# EAGLE design lab6 (EAGLE 7.2.0)
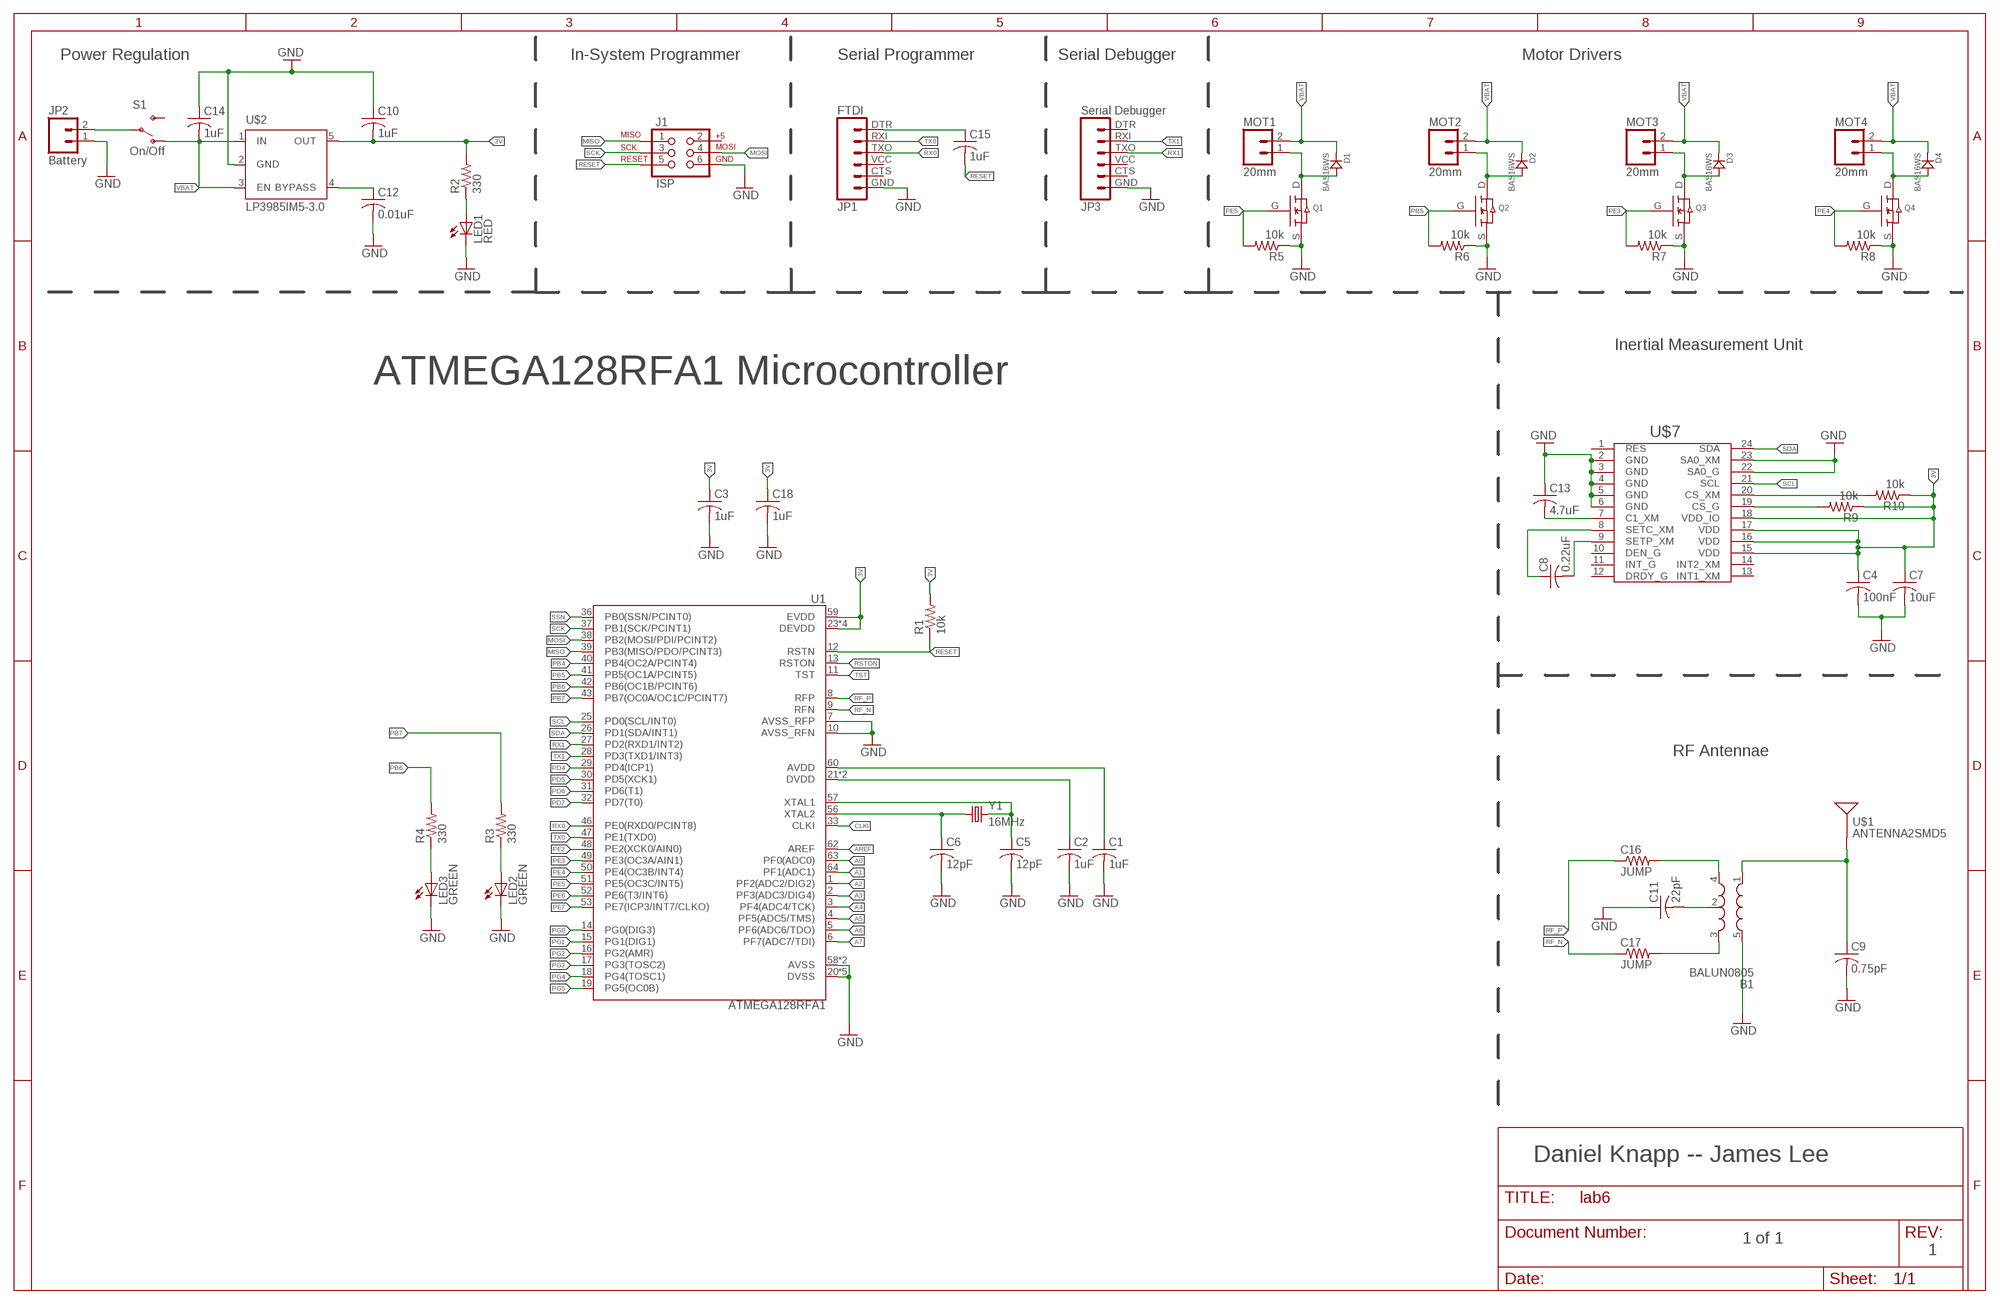
[diagram p0: schematic, sheet 1]

## Parts
B1  BALUN0805  [BALUN]
C1  1uF  C-USC0805  [C0805]
C2  1uF  C-USC0805  [C0805]
C3  1uF  C-USC0805  [C0805]
C4  100nF  C-USC0805  [C0805]
C5  12pF  C-USC0805  [C0805]
C6  12pF  C-USC0805  [C0805]
C7  10uF  C-USC0805  [C0805]
C8  0.22uF  C-USC0805  [C0805]
C9  0.75pF  C-USC0805  [C0805]
C10  1uF  C-USC0805  [C0805]
C11  22pF  C-USC0805  [C0805]
C12  0.01uF  C-USC0805  [C0805]
C13  4.7uF  C-USC0805  [C0805]
C14  1uF  C-USC0805  [C0805]
C15  1uF  C-USC0805  [C0805]
C16  JUMP  R-US_R0805  [R0805]
C17  JUMP  R-US_R0805  [R0805]
C18  1uF  C-USC0805  [C0805]
D1  BAS16WS  [BAS16WS]
D2  BAS16WS  [BAS16WS]
D3  BAS16WS  [BAS16WS]
D4  BAS16WS  [BAS16WS]
J1  ISP  AVR_SPI_PRG_6NS  [2X3-NS]
JP1  FTDI  FTDI_BASICPTH  [FTDI_BASIC]
JP2  Battery  M02PTH  [1X02]
JP3  Serial Debugger  FTDI_BASICPTH  [FTDI_BASIC]
LED1  RED  LEDCHIP-LED0805  [CHIP-LED0805]
LED2  GREEN  LEDCHIP-LED0805  [CHIP-LED0805]
LED3  GREEN  LEDCHIP-LED0805  [CHIP-LED0805]
MOT1  20mm  M02PTH  [1X02]
MOT2  20mm  M02PTH  [1X02]
MOT3  20mm  M02PTH  [1X02]
MOT4  20mm  M02PTH  [1X02]
Q1  SI2302CDS  [SI2302CDS]
Q2  SI2302CDS  [SI2302CDS]
Q3  SI2302CDS  [SI2302CDS]
Q4  SI2302CDS  [SI2302CDS]
R1  10k  R-US_R0805  [R0805]
R2  330  R-US_R0805  [R0805]
R3  330  R-US_R0805  [R0805]
R4  330  R-US_R0805  [R0805]
R5  10k  R-US_R0805  [R0805]
R6  10k  R-US_R0805  [R0805]
R7  10k  R-US_R0805  [R0805]
R8  10k  R-US_R0805  [R0805]
R9  10k  R-US_R0805  [R0805]
R10  10k  R-US_R0805  [R0805]
S1  On/Off  SWITCH-SPDTPTH  [SWITCH-SPDT]
U1  ATMEGA128RFA1  [QFN-64]
U$1  ANTENNA2SMD5  [ANTENNA-CHIP5]
U$2  LP3985IM5-3.0  [SOT23-DBV]
U$7  LSM9DS0  [LSM9DS0]
Y1  16MHz  CRYSTAL5X3  [CRYSTAL-SMD-5X3]

## Nets
3V: C3.1 C4.1 C7.1 C10.2 C18.1 R1.2 R2.2 R9.1 R10.1 U1.23(DEVDD) U1.34(DEVDD) U1.44(DEVDD) U1.54(DEVDD) U1.59(EVDD) U$2.5(OUT) U$7.15(VDD) U$7.16(VDD) U$7.17(VDD) U$7.18(VDD_IO)
A0: U1.63(PF0(ADC0))
A1: U1.64(PF1(ADC1))
A2: U1.1(PF2(ADC2/DIG2))
A3: U1.2(PF3(ADC3/DIG4))
A4: U1.3(PF4(ADC4/TCK))
A5: U1.4(PF5(ADC5/TMS))
A6: U1.5(PF6(ADC6/TDO))
A7: U1.6(PF7(ADC7/TDI))
AREF: U1.62(AREF)
CLKI: U1.33(CLKI)
GND: B1.5(GND) C1.2 C2.2 C3.2 C4.2 C5.2 C6.2 C7.2 C9.2 C10.1 C11.1 C12.2 C13.1 C14.1 C18.2 J1.6 JP1.GND JP2.1 JP3.GND LED1.C LED2.C LED3.C Q1.S Q2.S Q3.S Q4.S R5.1 R6.1 R7.1 R8.1 U1.7(AVSS_RFP) U1.10(AVSS_RFN) U1.20(DVSS) U1.24(DVSS) U1.35(DVSS) U1.45(DVSS) U1.55(DVSS) U1.58(AVSS) U1.61(AVSS) U$2.2(GND) U$7.2(GND) U$7.3(GND) U$7.4(GND) U$7.5(GND) U$7.6(GND) U$7.22(SA0_G) U$7.23(SA0_XM)
MISO: J1.1 U1.39(PB3(MISO/PDO/PCINT3))
MOSI: J1.4 U1.38(PB2(MOSI/PDI/PCINT2))
N$2: C12.1 U$2.4(BYPASS)
N$3: C15.1 JP1.DTR
N$4: LED1.A R2.1
N$5: C5.1 U1.57(XTAL1) Y1.3
N$6: JP2.2 S1.2(P)
N$7: C6.1 U1.56(XTAL2) Y1.1
N$8: C2.1 U1.21(DVDD) U1.22(DVDD)
N$9: C1.1 U1.60(AVDD)
N$10: B1.3(OUT2) C17.2
N$11: B1.2(GND) C11.2
N$12: B1.4(OUT1) C16.2
N$15: B1.1(IN) C9.1 U$1.FEED(SIGNAL)
N$16: LED3.A R4.1
N$17: LED2.A R3.1
N$18: D1.P$2 MOT1.1 Q1.D
N$20: D2.P$2 MOT2.1 Q2.D
N$22: D3.P$2 MOT3.1 Q3.D
N$24: D4.P$2 MOT4.1 Q4.D
N$25: C8.1 U$7.8(SETC_XM)
N$26: C8.2 U$7.9(SETP_XM)
N$27: C13.2 U$7.7(C1_XM)
N$29: R9.2 U$7.19(CS_G)
N$30: R10.2 U$7.20(CS_XM)
PB4: U1.40(PB4(OC2A/PCINT4))
PB5: Q2.G R6.2 U1.41(PB5(OC1A/PCINT5))
PB6: R4.2 U1.42(PB6(OC1B/PCINT6))
PB7: R3.2 U1.43(PB7(OC0A/OC1C/PCINT7))
PD4: U1.29(PD4(ICP1))
PD5: U1.30(PD5(XCK1))
PD6: U1.31(PD6(T1))
PD7: U1.32(PD7(T0))
PE2: U1.48(PE2(XCK0/AIN0))
PE3: Q3.G R7.2 U1.49(PE3(OC3A/AIN1))
PE4: Q4.G R8.2 U1.50(PE4(OC3B/INT4))
PE5: Q1.G R5.2 U1.51(PE5(OC3C/INT5))
PE6: U1.52(PE6(T3/INT6))
PE7: U1.53(PE7(ICP3/INT7/CLKO))
PG0: U1.14(PG0(DIG3))
PG1: U1.15(PG1(DIG1))
PG2: U1.16(PG2(AMR))
PG3: U1.17(PG3(TOSC2))
PG4: U1.18(PG4(TOSC1))
PG5: U1.19(PG5(OC0B))
RESET: C15.2 J1.5 R1.1 U1.12(RSTN)
RF_N: C17.1 U1.9(RFN)
RF_P: C16.1 U1.8(RFP)
RSTON: U1.13(RSTON)
RX0: JP1.TXO U1.46(PE0(RXD0/PCINT8))
RX1: JP3.TXO U1.27(PD2(RXD1/INT2))
SCK: J1.3 U1.37(PB1(SCK/PCINT1))
SCL: U1.25(PD0(SCL/INT0)) U$7.21(SCL)
SDA: U1.26(PD1(SDA/INT1)) U$7.24(SDA)
SSN: U1.36(PB0(SSN/PCINT0))
TST: U1.11(TST)
TX0: JP1.RXI U1.47(PE1(TXD0))
TX1: JP3.RXI U1.28(PD3(TXD1/INT3))
VBAT: C14.2 D1.P$1 D2.P$1 D3.P$1 D4.P$1 MOT1.2 MOT2.2 MOT3.2 MOT4.2 S1.1(O) U$2.1(IN) U$2.3(EN)
Unconnected: J1.2 JP1.CTS JP1.VCC JP3.CTS JP3.DTR JP3.VCC S1.3(S) U$7.1(RES) U$7.10(DEN_G) U$7.11(INT_G) U$7.12(DRDY_G) U$7.13(INT1_XM) U$7.14(INT2_XM)

## Notes on the sheet
- Power Regulation | In-System Programmer | Serial Programmer | Serial Debugger | Motor Drivers
- Inertial Measurement Unit
- ATMEGA128RFA1 Microcontroller
- RF Antennae
- Daniel Knapp -- James Lee
- 1 of 1
- 1

## Library data of the parts
B1 = lab5_comps:BALUN: 0805 footprint balun- Ember 351/357
C1-C15 C18 = lab5_comps:C-US: CAPACITOR, American symbol
C16 C17 R1-R10 = lab5_comps:R-US_: RESISTOR, American symbol
D1-D4 = lab5_comps:BAS16WS; CREATOR: Daniel Knapp; DIST: Digikey
J1 = lab5_comps:AVR_SPI_PRG_6: AVR ISP 6 Pin This is the reduced ISP connector for AVR programming. Common on Arduino. This footprint will take up less PCB space and can be used with a 10-pin to 6-pin adapter such as SKU: BOB-08508
JP1 JP3 = lab5_comps:FTDI_BASIC: FTDI Basic header with labels
JP2 MOT1-MOT4 = lab5_comps:M02: Header 2 Standard 2-pin 0.1" header. Use with straight break away headers (SKU : PRT-00116), right angle break away headers (PRT-00553), swiss pins (PRT-00743), machine pins (PRT-00117), and female headers (PRT-00115). Molex polarized connector foot print use with SKU : PRT-08233 with associated crimp pins and housings.
LED1-LED3 = lab5_comps:LED: LED OSRAM: - CHIPLED LG R971, LG N971, LY N971, LG Q971, LY Q971, LO R971, LY R971 LH N974, LH R974 LS Q976, LO Q976, LY Q976 LO Q996 - Hyper CHIPLED LW Q18S LB Q993, LB Q99A, LB R99A - SideLED LS A670, LO A670, LY A670, LG A670, LP A670 LB A673, LV A673, LT A673, LW A673 LH A674 LY A675 LS A676, LA A676, LO A676, LY A676, LW A676 LS A679, LY A679, LG A679 - Hyper Micro SIDELED® LS Y876, LA Y876, LO Y876, LY Y876 LT Y87S - SmartLED LW L88C, LW L88S LB L89C, LB L89S, LG L890 LS L89K, LO L89K, LY L89K LS L896, LA L896, LO L896, LY L896 - TOPLED LS T670, LO T670, LY T670, LG T670, LP T670 LSG T670, LSP T670, LSY T670, LOP T670, LYG T670 LG T671, LOG T671, LSG T671 LB T673, LV T673, LT T673, LW T673 LH T674 LS T676, LA T676, LO T676, LY T676, LB T676, LH T676, LSB T676, LW T676 LB T67C, LV T67C, LT T67C, LS T67K, LO T67K, LY T67K, LW E67C LS E67B, LA E67B, LO E67B, LY E67B, LB E67C, LV E67C, LT E67C LW T67C LS T679, LY T679, LG T679 LS T770, LO T770, LY T770, LG T770, LP T770 LB T773, LV T773, LT T773, LW T773 LH T774 LS E675, LA E675, LY E675, LS T675 LS T776, LA T776, LO T776, LY T776, LB T776 LHGB T686 LT T68C, LB T68C - Hyper Mini TOPLED® LB M676 - Mini TOPLED Santana® LG M470 LS M47K, LO M47K, LY M47K Source: http://www.osram.convergy.de LUXEON: - LUMILED® LXK2-PW12-R00, LXK2-PW12-S00, LXK2-PW14-U00, LXK2-PW14-V00 LXK2-PM12-R00, LXK2-PM12-S00, LXK2-PM14-U00 LXK2-PE12-Q00, LXK2-PE12-R00, LXK2-PE12-S00, LXK2-PE14-T00, LXK2-PE14-U00 LXK2-PB12-K00, LXK2-PB12-L00, LXK2-PB12-M00, LXK2-PB14-N00, LXK2-PB14-P00, LXK2-PB14-Q00 LXK2-PR12-L00, LXK2-PR12-M00, LXK2-PR14-Q00, LXK2-PR14-R00 LXK2-PD12-Q00, LXK2-PD12-R00, LXK2-PD12-S00 LXK2-PH12-R00, LXK2-PH12-S00 LXK2-PL12-P00, LXK2-PL12-Q00, LXK2-PL12-R00 Source: www.luxeon.com KINGBRIGHT: KA-3528ASYC Source: www.kingbright.com
Q1-Q4 = lab5_comps:SI2302CDS; CREATOR: Daniel Knapp; DIST: Digikey
S1 = lab5_comps:SWITCH-SPDT: SPDT Switch Simple slide switch, Spark Fun Electronics SKU : COM-00102 DPDT SMT slide switch, AYZ0202, SWCH-08179; PROD_ID: SWCH-08261
U1 = lab5_comps:ATMEGA128RFA1: ATmega128RFA1 8-bit AVR Microcontroller with Low Power 2.4GHz Transceiver for ZigBee and IEEE 802.15.4
U$1 = lab5_comps:ANTENNA2: Chip antenna Single endded antenna. Common with smaller chip antennas. CHIP4 package is the GPS Chip Antenna SKU: GPS-08418. CHIP5 package is 2.4GHz chip antenna SKU: WRL-00144.
U$2 = lab5_comps:LP3985IM5-3.0
U$7 = lab5_comps:LSM9DS0; CREATOR: Daniel Knapp; DIST: Digikey
Y1 = lab5_comps:CRYSTAL: Various standard crystals. Proven footprints. Spark Fun Electronics SKU : COM-00534

## Board
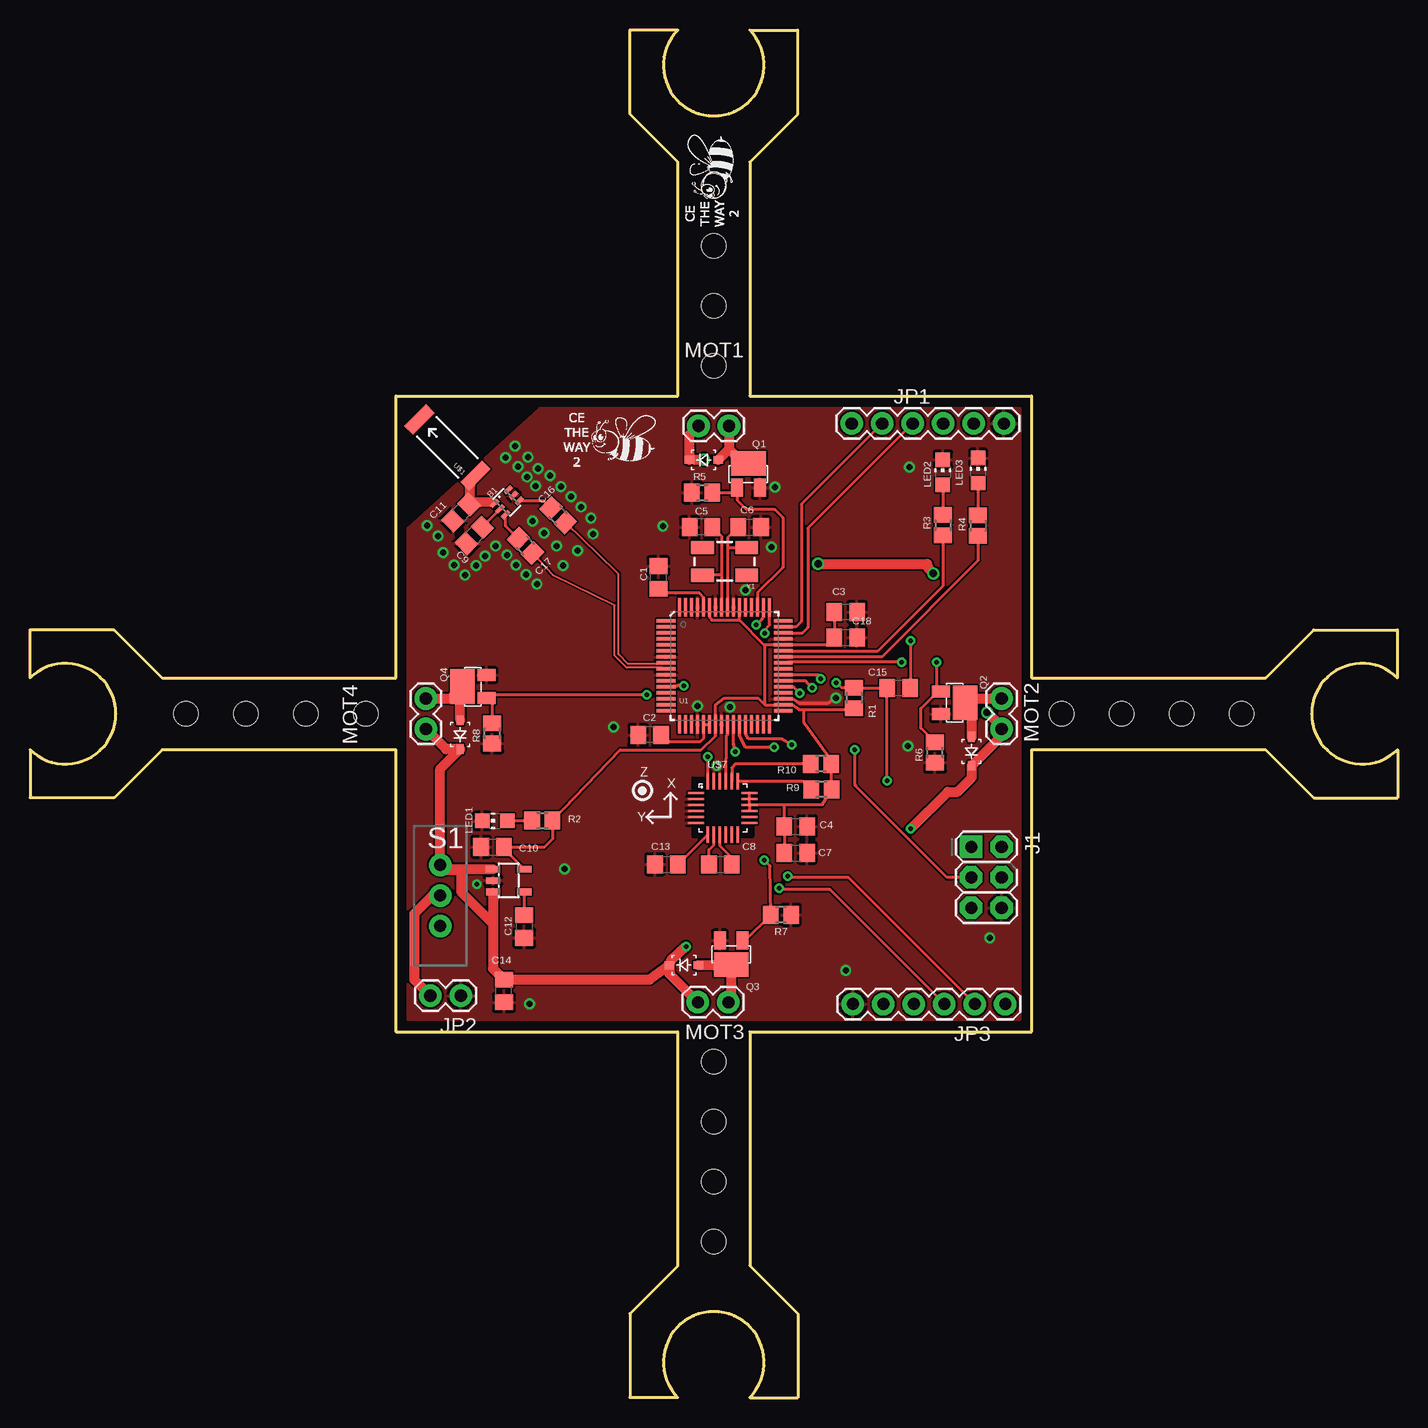
[diagram p1: board, top side]
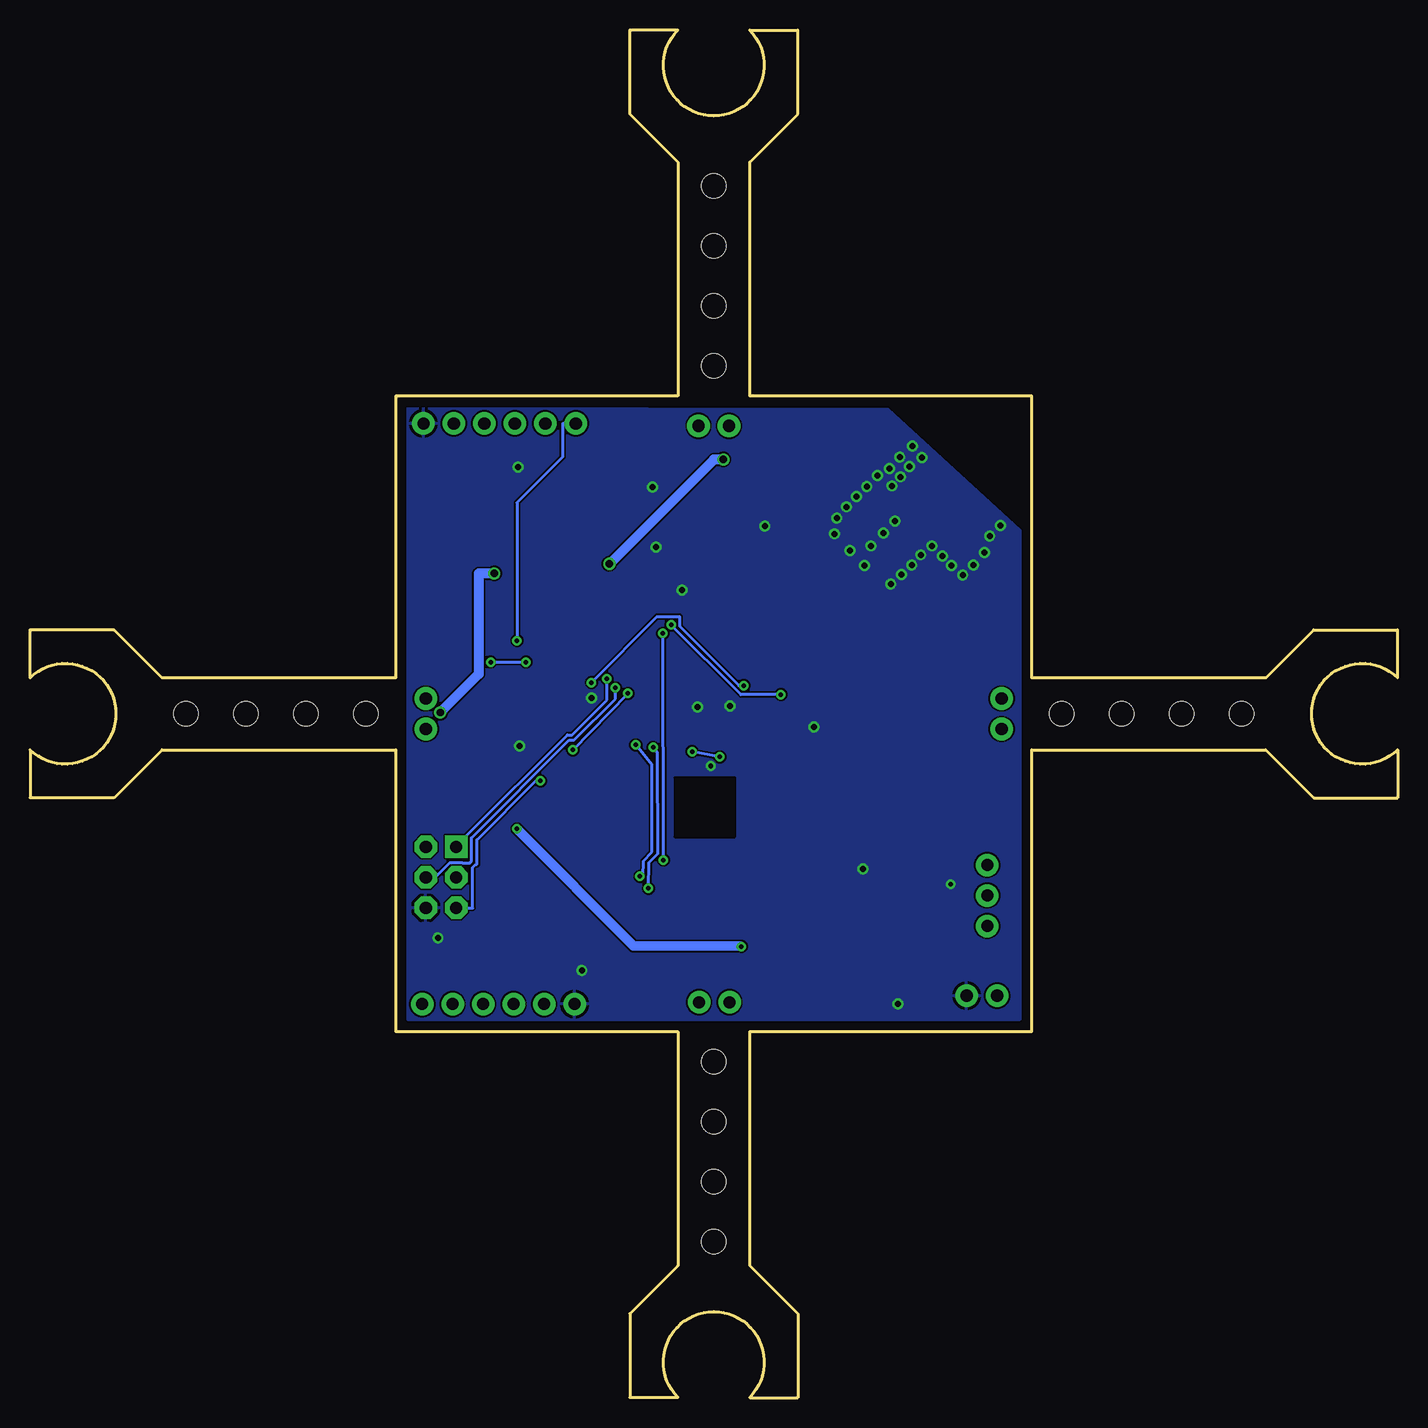
[diagram p2: board, bottom side, seen from below]

Size 114 x 114 mm. Coordinates in mm from the lower left corner, seen from the top.
Outline: 54,83.5 54,103 50,107 50,114 54,114 arc269 60,114 64,114 64,107 60,103 60,83.5 83.5,83.5 83.5,60 103,60 107,64 114,64 114,60 arc269 114,54 114,50 107,50 103,54 83.5,54 83.5,30.5 60,30.5 60,11 64,7 64,0 60,0 arc269 54,0 50,0 50,7 54,11 54,30.5 30.5,30.5 30.5,54 11,54 7,50 0,50 0,54 arc269 0,60 0,64 7,64 11,60 30.5,60 30.5,83.5 54,83.5
Copper layers (1*16): Top 0.035559375mm / dielectric 1.501140625mm / Bottom 0.035559375mm
Design rules "4pcb-33board": minimum track width 6mil, minimum drill 15mil, track to track 6mil, track to pad 6mil, pad to pad 6mil, via to via 6mil, smd to smd 6mil, copper to edge 10mil, drill to drill 10mil, minimum pad ring 10mil, minimum via ring 8mil, stop-mask expansion 4mil, vias tented up to drill 0mil, thermal gap 10mil
Holes 2 mm at 13,57 18,57 23,57 28,57 86,57 91,57 96,57 101,57 57,28 57,23 57,18 57,13 57,86 57,91 57,96 57,101
tRestrict: area 31,72.5 to 42.5,83; area 55.5,47 to 60.1,51.5
bRestrict: area 31,72.5 to 42.5,83; area 55.5,47 to 60.1,51.5

### Footprints (pad centres in the part's own frame; a part is rotated, then mirrored left to right if it is on the bottom)
BALUN = smd 0.35 x 0.8: 1 -0.65,-0.8; 2 0,-0.8; 3 0.65,-0.8; 4 0.65,0.8; 5 0,0.8; 6 -0.65,0.8
C0805 = smd 1.3 x 1.5: 1 -0.95,0; 2 0.95,0
R0805 = smd 1.3 x 1.5: 1 -0.85,0; 2 0.85,0
BAS16WS = smd 0.8 x 0.6: P$1 -1.2,0; P$2 1.2,0
2X3-NS = drill 1.016 pad 1.88 square: 1 -2.54,-1.27 | drill 1.016 pad 1.88 octagon: 2 -2.54,1.27; 3 0,-1.27; 4 0,1.27; 5 2.54,-1.27; 6 2.54,1.27
FTDI_BASIC = drill 1.016 pad 1.88: CTS 10.16,0; DTR 0,0; GND 12.7,0; RXI 2.54,0; TXO 5.08,0; VCC 7.62,0
1X02 = drill 1.016 pad 1.88: 1 -1.27,0; 2 1.27,0
CHIP-LED0805 = smd 1.2 x 1.2: A 0,-1.05; C 0,1.05
SI2302CDS = smd 2.9 x 2.05: D 0,0.875 | smd 1 x 1.5: G -0.95,-1.15; S 0.95,-1.15
SWITCH-SPDT = drill 1.016 pad 1.88: 1 0,2.54; 2 0,0; 3 0,-2.54
QFN-64 = smd 1.562 x 0.28: 1 -4.881,3.75; 2 -4.881,3.25; 3 -4.881,2.75; 4 -4.881,2.25; 5 -4.881,1.75; 6 -4.881,1.25; 7 -4.881,0.75; 8 -4.881,0.25; 9 -4.881,-0.25; 10 -4.881,-0.75; 11 -4.881,-1.25; 12 -4.881,-1.75; 13 -4.881,-2.25; 14 -4.881,-2.75; 15 -4.881,-3.25; 16 -4.881,-3.75; 33 4.881,-3.75; 34 4.881,-3.25; 35 4.881,-2.75; 36 4.881,-2.25; 37 4.881,-1.75; 38 4.881,-1.25; 39 4.881,-0.75; 40 4.881,-0.25; 41 4.881,0.25; 42 4.881,0.75; 43 4.881,1.25; 44 4.881,1.75; 45 4.881,2.25; 46 4.881,2.75; 47 4.881,3.25; 48 4.881,3.75 | smd 0.28 x 1.562: 17 -3.75,-4.881; 18 -3.25,-4.881; 19 -2.75,-4.881; 20 -2.25,-4.881; 21 -1.75,-4.881; 22 -1.25,-4.881; 23 -0.75,-4.881; 24 -0.25,-4.881; 25 0.25,-4.881; 26 0.75,-4.881; 27 1.25,-4.881; 28 1.75,-4.881; 29 2.25,-4.881; 30 2.75,-4.881; 31 3.25,-4.881; 32 3.75,-4.881; 49 3.75,4.881; 50 3.25,4.881; 51 2.75,4.881; 52 2.25,4.881; 53 1.75,4.881; 54 1.25,4.881; 55 0.75,4.881; 56 0.25,4.881; 57 -0.25,4.881; 58 -0.75,4.881; 59 -1.25,4.881; 60 -1.75,4.881; 61 -2.25,4.881; 62 -2.75,4.881; 63 -3.25,4.881; 64 -3.75,4.881
ANTENNA-CHIP5 = smd 1.016 x 2.54: FEED -3.302,0; NC 3.302,0
SOT23-DBV = smd 0.55 x 1.2: 1 -0.95,-1.3; 2 0,-1.3; 3 0.95,-1.3; 4 0.95,1.3; 5 -0.95,1.3
LSM9DS0 = smd 1.35 x 0.2: 1 -2.225,1.25; 2 -2.225,0.75; 3 -2.225,0.25; 4 -2.225,-0.25; 5 -2.225,-0.75; 6 -2.225,-1.25; 13 2.225,-1.25; 14 2.225,-0.75; 15 2.225,-0.25; 16 2.225,0.25; 17 2.225,0.75; 18 2.225,1.25 | smd 0.2 x 1.35: 7 -1.25,-2.225; 8 -0.75,-2.225; 9 -0.25,-2.225; 10 0.25,-2.225; 11 0.75,-2.225; 12 1.25,-2.225; 19 1.25,2.225; 20 0.75,2.225; 21 0.25,2.225; 22 -0.25,2.225; 23 -0.75,2.225; 24 -1.25,2.225
CRYSTAL-SMD-5X3 = smd 1.9 x 1.1: 1 -1.85,-1.15; 2 1.85,-1.15; 3 1.85,1.15; 4 -1.85,1.15

### Placement (x,y rotation side)
B1  39.76,74.64 315 top
C1  52.39,68.36 90 top
C2  51.65,55.25 180 top
C3  68,65.5 0 top
C4  63.83,47.61 0 top
C5  55.94,72.56 180 top
C6  59.99,72.56 0 top
C7  63.83,45.41 0 top
C8  57.55,44.45 0 top
C9  35.93,73.76 225 top
C10  38.55,45.9 0 top
C11  37.04,71.87 45 top
C12  41.19,39.26 270 top
C13  53.05,44.45 0 top
C14  39.5,33.9 90 top
C15  72.42,59.13 180 top
C16  44.03,73.54 135 top
C17  41.3,71 135 top
C18  68,63.35 0 top
D1  56.16,78.16 0 top
D2  78.48,53.86 90 top
D3  54.5,36.05 0 top
D4  35.86,55.26 90 top
J1  79.74,43.36 270 top
JP1  68.5,81.2 0 top
JP2  34.65,33.5 180 top
JP3  81.3,32.8 180 top
LED1  38.75,48.07 90 top
LED2  76.09,77.13 0 top
LED3  79.04,77.28 0 top
MOT1  57,81 180 top
MOT2  81,57 270 top
MOT3  56.95,32.95 180 top
MOT4  33,57 270 top
Q1  59.89,76.99 0 top
Q2  77.09,57.92 270 top
Q3  58.45,36.95 180 top
Q4  36.91,59.26 90 top
R1  68.7,58.32 270 top
R2  42.7,48.1 0 top
R3  76.11,72.72 270 top
R4  79.04,72.68 270 top
R5  56.03,75.44 0 top
R6  75.44,53.77 90 top
R7  62.6,40.25 180 top
R8  38.54,55.37 90 top
R9  65.97,50.69 180 top
R10  65.94,52.83 180 top
S1  34.2,41.85 0 top
U1  57.9,61 0 top
U$1  34.8,79.2 135 top
U$2  39.9,43.1 270 top
U$3  [BEE_LOGO]  48.4,79.7 0 top
U$4  [BEE_LOGO]  57,101.5 90 top
U$7  57.75,49.15 0 top
Y1  57.9,69.7 180 top

### Tracks (layer width: path | path; a pad name or v marks a point on that pad's centre or on a via)
3V
  Top 0.254: 61.25,57.75 U1.34 63.55,57.75 64.1,57.35 64.5,57.35 | 62.9,49.4 66.03,49.4 R9.1 66.79,50.72 R10.1 67.15,53.19 66.71,53.19 64.5,56.25 64.5,57.35 | 62.9,49.4 U$7.16 | U$7.16 U$7.17 U$7.18 | U$7.16 U$7.15 | 62.9,49.4 62.9,47.63 C4.1 C7.1 | 64.5,57.35 68.43,57.35 R1.2 | C18.1 66.45,62.75 U1.44 61.25,62.75 | C3.1 C18.1 | 61.25,62.75 61.2,62.75 59.15,64.8 | 59.15,64.8 U1.54 | U1.59 56.65,65.1 56.85,64.8 59.15,64.8 | 67.15,63.25 C18.1 | 61.25,57.75 61.25,62.75 | 61.25,57.75 60.7,58.3 57.9,58.3 57.15,57.75 U1.23 57.15,55.15 55.95,54 49.2,54 R2.2 43.6,48.05 43.6,46.6 42.9,45.9 C10.2 39.5,45.75 U$2.5
GND  (via drill 0.4, 0.5)
  Top 0.254: U1.35 63.6,58.25 64.1,57.9 66.5,57.9 v67.2,58.3
  other vias: 34,71.8 33.1,72.7 37.25,42.8 55.65,57.65 58.35,57.55 59.65,67.3 57.25,52.65 44.55,44.05 41.65,32.8 80,38.3 73.3,77.55 52.75,72.65 34.45,70.45 35.35,69.4 36.25,68.55 37.2,69.35 37.95,70.15 38.8,71 39.75,70.25 40.5,69.4 41.35,68.6 44.45,69.35 45.65,70.6 43.9,71 42.85,72.05 41.9,73.05 46.95,72 46.75,73.3 45.95,74.25 45.1,75.1 44.25,75.95 43.35,76.85 42.15,76 41.45,76.75 40.7,77.6 39.65,78.35 40.45,79.3 41.5,78.4 42.35,77.45 61.8,70.9 62.1,75.9 48.65,55.9 68,35.6 73.2,54.3 42.25,67.8
  pour Bottom: 31.5,31.5 82.5,31.5 82.5,82.5 42.5,82.4 31.5,72.3
  pour Top: 31.5,72.5 42.5,82.5 82.5,82.5 82.5,31.5 31.5,31.5
MISO  (via drill 0.38)
  Top 0.254: U1.39 65.7,60.25 65.9,60.05 v65.9,59.9
  Bottom 0.254: v65.9,59.9 65.9,58.15 68.8,55.25 69.2,55.25 77.65,46.8 77.65,45.9 78.45,45.9 J1.1
MOSI  (via drill 0.38)
  Top 0.254: 65.2,59.05 v65.2,59.15 65.15,59.15 64.65,59.75 U1.38
  Bottom 0.254: v65.2,59.15 65.2,58.25 68.65,54.8 69.05,54.8 77.2,46.65 77.2,44.7 77.35,44.55 77.9,44.55 77.95,44.6 79,44.6 80.25,43.35 J1.4
N$2
  Top 0.254: U$2.4 C12.1
N$3  (via drill 0.38)
  Top 0.254: 73.35,59.15 C15.1 73.4,59.2 v73.4,63.1
  Bottom 0.254: v73.4,63.1 73.4,74.6 69.6,78.4 69.6,81.2 JP1.DTR
N$4
  Top 0.254: R2.1 41.82,48.07 LED1.A
N$5
  Top 0.254: C5.1 57.65,71.8 57.65,68.6 | 57.65,68.6 U1.57 | Y1.3 56.1,68.6 57.65,68.6
N$6
  Top 0.813: JP2.2 32.05,34.83 32.05,40.35 33.55,41.85 S1.2
N$7
  Top 0.254: C6.1 58.15,71.67 58.15,70.8 | 58.15,70.8 U1.56 | Y1.1 59.7,70.8 58.15,70.8
N$8
  Top 0.254: C2.1 52.61,54.69 52.65,54.65 55.85,54.65 56.15,54.95 U1.21 U1.22
N$9
  Top 0.254: U1.60 56.15,66.7 55.8,67.05 53.85,67.05 53.04,67.06 C1.1
N$10
  Top 0.254: C17.2 39.65,72.65 B1.3
N$11
  Top 0.254: B1.2 37.71,72.59 C11.2
N$12
  Top 0.254: C16.2 42.82,74.75 B1.4
N$13
  cutout Top: 55.25,51.65 60.25,51.65 60.25,46.75 55.25,46.75
  cutout Bottom: 55.25,51.65 60.25,51.65 60.25,46.75 55.25,46.75
N$15
  Top 0.254: U$1.FEED 37.07,76.8 37.05,76.8 36.7,76.45 36.7,76.05 | B1.1 38.62,74.65 38.55,74.65
  Top 0.813: 36.7,76.05 36.7,74.53 C9.1 36.87,74.7 38.55,74.65
N$16
  Top 0.254: LED3.A R4.1
N$17
  Top 0.254: LED2.A 76.09,73.59 R3.1
N$18
  Top 0.254: Q1.D 59.48,77.86
  Top 0.813: MOT1.1 58.27,79.07 | 58.27,79.07 D1.P$2 | 59.48,77.86 58.27,79.07
N$20
  Top 0.254: 78.48,57.41 Q2.D 78.31,58.27
  Top 0.813: 78.48,57.41 D2.P$2 | 78.31,58.27 MOT2.1
N$22
  Top 0.254: 58.42,36.05 Q3.D | 58.45,33.18 MOT3.1
  Top 0.813: D3.P$2 58.42,36.05 | Q3.D 58.45,33.18
N$24
  Top 0.813: MOT4.1 35.05,58.27 35.51,58.74 | 35.51,58.74 Q4.D | D4.P$2 35.86,58.39 35.51,58.74
N$25
  Top 0.254: C8.1 56.6,45.65 57,46.05 U$7.8
N$26
  Top 0.254: C8.2 58.5,45 57.5,46 U$7.9
N$27
  Top 0.254: C13.2 54.02,44.45 U$7.7
N$29
  Top 0.254: R9.2 64.44,51.38 U$7.19
N$30
  Top 0.254: R10.2 58.83,52.83 58.5,52.5 U$7.20
PB5  (via drill 0.38)
  Top 0.254: v75.6,61.3 75.6,58.85 75.9,58.85 Q2.G 75.67,58.87 74.25,57.45 74.25,55.81 R6.2 | U1.41 63.15,61.25 63.2,61.3 v72.65,61.3
  Bottom 0.254: v75.6,61.3 v72.65,61.3
PB6
  Top 0.254: R4.2 79.04,69.79 71,61.75 U1.42
PB7
  Top 0.254: R3.2 76.11,67.66 70.65,62.2 62.83,62.2 U1.43
PE3  (via drill 0.38)
  Top 0.254: Q3.G 59.6,38.1 R7.2 61.7,44.25 61.65,44.35 v61.2,44.8 | v61.25,63.7 61.25,64 61.65,64.4 U1.49
  Bottom 0.254: v61.2,44.8 v61.25,63.7
PE4  (via drill 0.38)
  Top 0.254: R8.2 38.54,57.83 Q4.G 38.25,58.6 v51.4,58.6 | U1.50 61.15,65.05 60.6,64.45 v60.55,64.4
  Bottom 0.254: v60.55,64.4 54.75,58.6 v51.4,58.6
PE5
  Top 0.254: R5.2 58.54,75.44 Q1.G 58.94,74.81 59.7,74.05 62.05,74.05 62.75,73.35 62.75,69.2 60.65,67.1 U1.51
RESET  (via drill 0.38)
  Top 0.254: U1.12 53.6,59.25 53.65,59.3 53.9,59.3 53.95,59.35 v54.5,59.35 | v67.2,59.6 67.7,59.15 68.6,59.15 R1.1 68.7,59.15 71.45,59.15 C15.2 71.45,59.05 v71.45,51.4
  Bottom 0.254: v54.5,59.35 54.9,59.35 59.85,64.3 59.85,65.1 61.75,65.1 v67.2,59.6 | v71.45,51.4 71.85,51.4 76.75,46.5 76.75,44.45 76.85,44.45 77.1,44.2 77.1,40.8 78.45,40.8 J1.5
RF_N
  Top 0.152: C17.1 43.6,68.55 48.75,66.05 48.75,61.84 49.74,60.85 52.7,60.85 52.8,60.75 U1.9
RF_P
  Top 0.152: C16.1 48.87,68.85 49.05,68.65 49.05,61.96 49.86,61.15 52.7,61.15 52.8,61.25 U1.8
RX0
  Top 0.254: U1.46 62.83,63.7 64.35,63.7 64.85,64.2 64.85,72.47 JP1.TXO
RX1  (via drill 0.38)
  Top 0.254: JP3.TXO 66.67,42.35 62.45,42.35 | 62.45,42.35 62.4,42.35 | v62.05,54.2 59.65,54.2 59.15,55.25 U1.27 | v62.45,42.45 62.45,42.35
  Bottom 0.254: v62.05,54.2 61.7,53.75 61.65,45.35 62.4,44.6 v62.45,42.45
SCK  (via drill 0.38)
  Top 0.254: J1.3 76.44,43.36 68.8,51 68.75,51.1 v68.75,54 | U1.37 63.65,59.25 v64.15,58.7
  Bottom 0.254: v68.75,54 v64.15,58.7
SCL
  Top 0.254: U$7.21 58.05,55.15 58.15,55.25 U1.25
SDA  (via drill 0.38)
  Top 0.254: U$7.24 v56.5,53.4 | v58.8,53.85 58.65,54.5 U1.26
  Bottom 0.254: v56.5,53.4 v58.8,53.85
TX0
  Top 0.254: U1.47 63.85,64.25 64.3,64.7 64.3,74.46 JP1.RXI
TX1  (via drill 0.38)
  Top 0.254: JP3.RXI 68.21,43.35 63.2,43.35 v63.15,43.45 | v63.5,54.4 62.65,54.9 59.9,54.9 59.65,55.35 U1.28
  Bottom 0.254: v63.5,54.4 62.15,52.75 62.15,45.5 62.85,44.75 62.9,43.45 v63.15,43.45
VBAT  (via drill 0.38, 0.6)
  Top 0.254: U$2.3 38.6,42.1
  Top 0.813: S1.1 34.54,44.05 U$2.1 | S1.1 34.2,44 35.9,44 35.95,43.95 35.95,42.15 38.6,39.5 | S1.1 | 38.6,42.1 38.6,39.5 | 38.6,39.5 38.6,35.75 C14.2 51.65,34.85 D3.P$1 | S1.1 34.2,52.4 D4.P$1 34.67,54.06 MOT4.2 | D3.P$1 53.3,35.33 MOT3.2 | v73.4,47.4 76.5,50.5 77.3,50.5 78.5,51.7 78.5,52.64 D2.P$1 81,55.18 MOT2.2 80.8,56.1 v79.8,57.1 | v54.7,37.6 53.45,36.45 D3.P$1 | MOT1.2 54.96,80.23 D1.P$1 55.3,78.2 v56.2,78.2 | v65.7,69.5 74.8,69.5 74.9,69.1 v75.3,68.7
  Bottom 0.813: v73.4,47.4 63.7,37.65 v54.7,37.6 | v65.7,69.5 57,78.2 v56.2,78.2 | v79.8,57.1 76.6,60.3 76.6,68.7 v75.3,68.7

### Text on the board
tPlace: Z | X | Y